# Altium project Schema_MaletteDevasion.PrjPcb
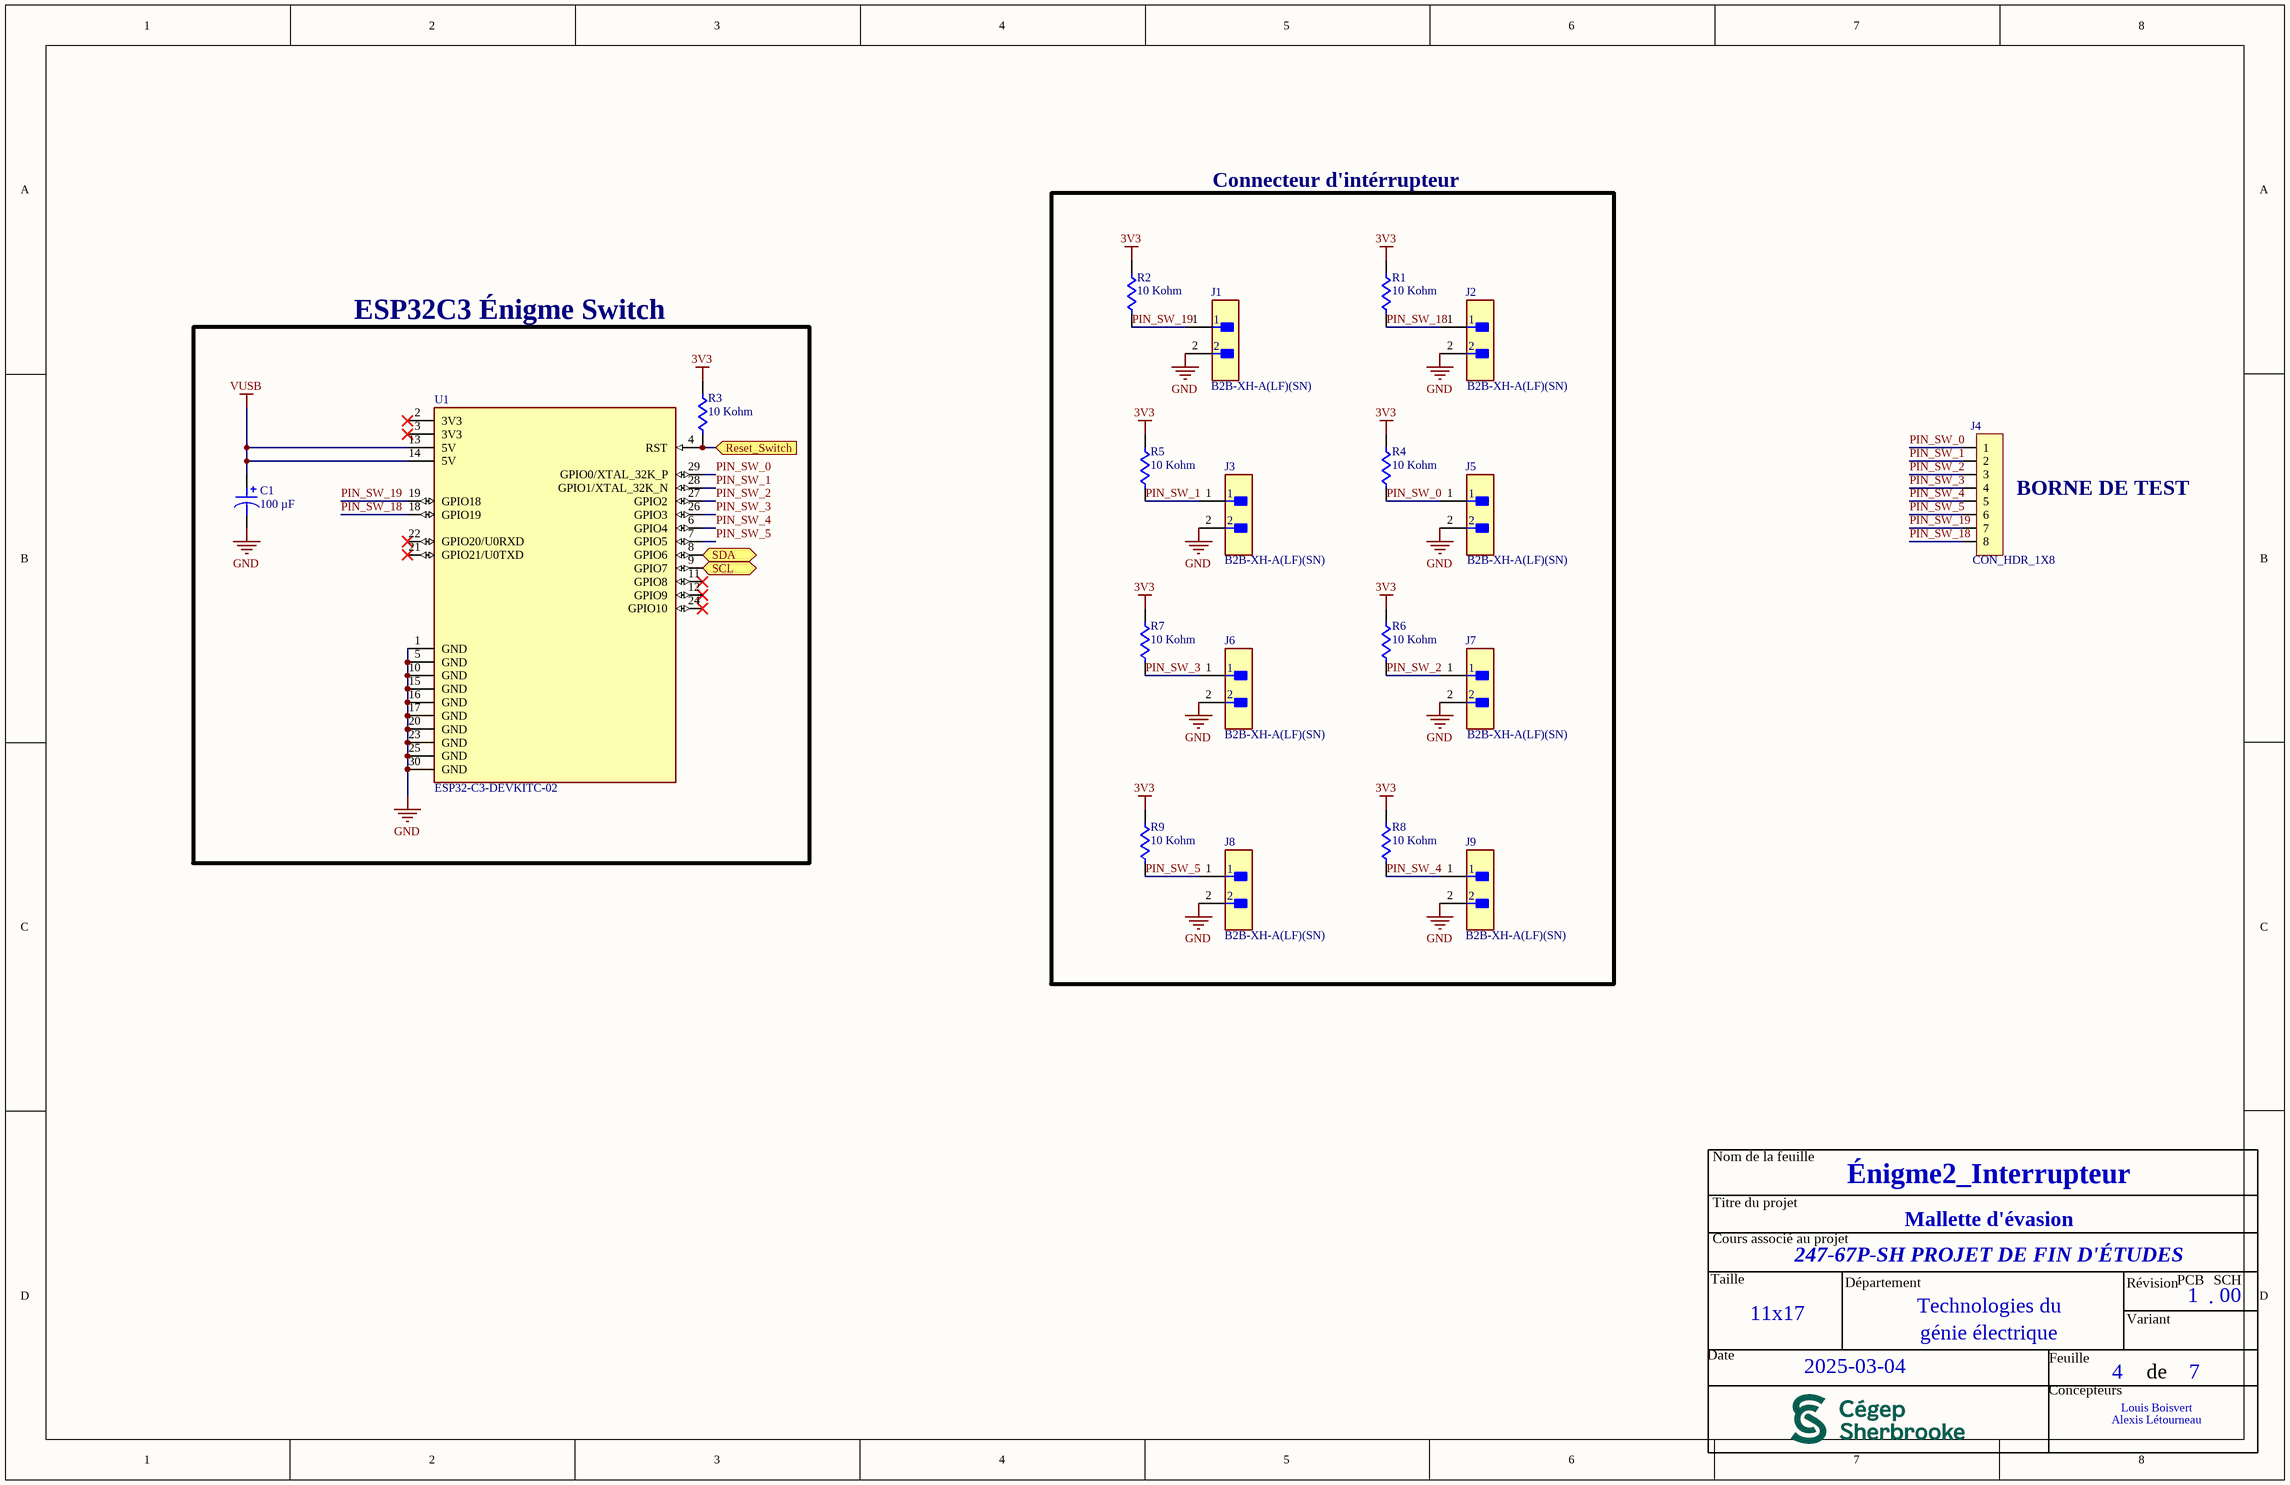
[diagram p0: Énigme1_Switch.SchDoc]
Projet_Concepteur1: Louis Boisvert; Projet_Concepteur2: Alexis Létourneau; Projet_Date: 2025-03-04; Projet_nom_du_cours: 247-67P-SH PROJET DE FIN D'ÉTUDES; Projet_PCB_Rev: 1; Projet_SCH_Rev: 00; Projet_stencil_Bot_epaisseur: 0.1 MM; Projet_stencil_Top_epaisseur: 0.1 MM; Projet_Titre: Mallette d'évasion
4 sheets, 82 parts. Net scope: flat (ports and power ports of the same name join across sheets).
Board files: TEMPLATE_PCB_2L.PcbDoc, MalletteV2_PCB_2L.PcbDoc
Sheets:
  Énigme1_Switch.SchDoc
  Énigme2_Crocodile.SchDoc
  Énigme3_Potentiomètres.SchDoc
  Raspberry_Pi_4_ModelB.SchDoc

## Sheet Énigme1_Switch.SchDoc
size Tabloid; DocumentNumber: 4; SheetNumber: 4; SheetTotal: 7; Sheet_Name: Énigme2_Interrupteur; Size: 11x17; SPICEModelCache: <root> / <DocumentId>IJWHLXDW</DocumentId> / </root>

### Parts
C1  100 µF  [CAP AL TH D8 L3.5 H12.5]
J1  B2B-XH-A(LF)(SN)  [FP-B2B-XH-A_LF_SN-MFG]
J2  B2B-XH-A(LF)(SN)  [FP-B2B-XH-A_LF_SN-MFG]
J3  B2B-XH-A(LF)(SN)  [FP-B2B-XH-A_LF_SN-MFG]
J4  CON_HDR_1X8  [CON_HDR_1x8]
J5  B2B-XH-A(LF)(SN)  [FP-B2B-XH-A_LF_SN-MFG]
J6  B2B-XH-A(LF)(SN)  [FP-B2B-XH-A_LF_SN-MFG]
J7  B2B-XH-A(LF)(SN)  [FP-B2B-XH-A_LF_SN-MFG]
J8  B2B-XH-A(LF)(SN)  [FP-B2B-XH-A_LF_SN-MFG]
J9  B2B-XH-A(LF)(SN)  [FP-B2B-XH-A_LF_SN-MFG]
R1  10 Kohm  [Res_Template]
R2  10 Kohm  [Res_Template]
R3  10 Kohm  [Res_Template]
R4  10 Kohm  [Res_Template]
R5  10 Kohm  [Res_Template]
R6  10 Kohm  [Res_Template]
R7  10 Kohm  [Res_Template]
R8  10 Kohm  [Res_Template]
R9  10 Kohm  [Res_Template]
U1  ESP32-C3-DEVKITC-02  [XCVR_ESP32-C3-DEVKITC-02]

### Blocks framed on the sheet
Connecteur d'intérrupteur: J1-J3 J5-J9 R1 R2 R4-R9
ESP32C3 Énigme Switch: C1 R3 U1

### Ports
Reset_Switch (in), SCL (bidir), SDA (bidir)

### Nets
3V3: R1.2 R2.2 R3.2 R4.2 R5.2 R6.2 R7.2 R8.2 R9.2
GND: C1.2 J1.2 J2.2 J3.2 J5.2 J6.2 J7.2 J8.2 J9.2 U1.1(GND) U1.5(GND) U1.10(GND) U1.15(GND) U1.16(GND) U1.17(GND) U1.20(GND) U1.23(GND) U1.25(GND) U1.30(GND)
VUSB: C1.1 U1.13(5V) U1.14(5V)
PIN_SW_0: J4.1 J5.1 R4.1 U1.29(GPIO0/XTAL_32K_P)
PIN_SW_1: J3.1 J4.2 R5.1 U1.28(GPIO1/XTAL_32K_N)
PIN_SW_2: J4.3 J7.1 R6.1 U1.27(GPIO2)
PIN_SW_3: J4.4 J6.1 R7.1 U1.26(GPIO3)
PIN_SW_4: J4.5 J9.1 R8.1 U1.6(GPIO4)
PIN_SW_5: J4.6 J8.1 R9.1 U1.7(GPIO5)
PIN_SW_18: J2.1 J4.8 R1.1 U1.18(GPIO19)
PIN_SW_19: J1.1 J4.7 R2.1 U1.19(GPIO18)
Reset_Switch: R3.1 U1.4(RST) ; port Reset_Switch
SCL: U1.9(GPIO7) ; port SCL
SDA: U1.8(GPIO6) ; port SDA

Not connected (* = marked no-connect by the designer): U1 2(3V3)* 3(3V3)* 11(GPIO8)* 12(GPIO9)* 21(GPIO21/U0TXD)* 22(GPIO20/U0RXD)* 24(GPIO10)*

### Notes on the sheet
- (near J4) BORNE DE TEST
- Nom de la feuille
- Titre du projet
- Cours associé au projet
- Taille
- Département
- Technologies du
- Révision
- PCB
- .
- SCH
- Date
- génie électrique
- Feuille
- Variant
- de
- Concepteurs

### Library data of the parts
C1 = 860020674015: CAP ALUM 100UF 20% 50V RADIAL; manufacturer: Würth Elektronik; Lifetime @ Temp.: 2000 Hrs @ 105°C; Polarization: Polar; Ripple Current @ High Frequency: 306 mA @ 100 kHz; Ripple Current @ Low Frequency: 200 mA @ 120 Hz; Part Number: 860020674015; Applications: General Purpose; Capacitance: 100 µF; componentlink1description: Datasheet; componentlink1url: https://katalog.we-online.de/pbs/datasheet/860020674015.pdf; componentlink2description: DigiKey Link; componentlink2url: https://www.digikey.com/en/products/detail/würth-elektronik/860020674015/5727098; Device Package: Radial, Can; Height - Seated (Max): 0.492" (12.50mm); lastupdated: 2024-06-03 20:06:11; Lead Spacing: 0.138" (3.50mm); Lifecycle Status: Active; Minimum Order: 1; Mounting Type: Through Hole; Operating Temperature: -40°C ~ 105°C; Package / Case: Radial, Can; packaging: TapeAndBox; partid: 7238; Part Status: Active; price: 0.16; series: WCAP-ATG5; Size / Dimension: 0.315" Dia (8.00mm); Supplier 1: DigiKey; Supplier Part Number 1: 732-8861-1-ND; Tolerance: ±20%; value: 100 µF; Voltage - Rated: 50 V
J1-J3 J5-J9 = CMP-2000-05888-3: CONN HEADER VERT 2POS 2.5MM; Current Rating: 3A; Voltage Rating: 250V; Number of Contacts: 2; Contact Resistance: 20mR; Wire/Cable Gauge: 22AWG; Insulation Resistance: 1GR; Connector Type: Male Pin; Packaging: Bulk; Contact Material: Brass; Lead Free: Lead Free; Orientation: Straight; Contact Plating: Tin; Max Current Rating: 3A; Termination: Solder; Fastening Type: Detent; Depth: 5.75mm; Housing Material: Polyamide; REACH SVHC: No SVHC; Series: XH; Voltage Rating (AC): 250V; Number of Positions: 2; Color: Natural; Contact Type: Male Pin; Max Voltage Rating (DC): 250V; Pitch: 2.5mm; Lead Pitch: 2.5mm; Mount: Through Hole; Max Operating Temperature: 85°C; Length: 7.4mm; Max Voltage Rating (AC): 250V; Min Operating Temperature: -25°C; Number of Rows: 1; Housing Color: White
J4 = CMP-005-000004-1: CON - Header 1X8 pins, 100Mils - TH-8; Polarized: No; Note: *; Power Max: *; Component Type: Standard; Manufacturer #1: *; Design Item ID: CON_HDR_1X8; Assembly Type: TH; HelpURL: *; Pin Count: 8; Package: TH-8; Source: CEGEP_SHERBROOKE_TGE_LIBRARY.SchLib
R1-R9 = 470 ohm: Custom Semiconductor Resistor
U1 = ESP32-C3-DEVKITC-02: Development Boards & Kits - Wireless (Engineering Samples) ESP32-C3 General-Purpose Development Board, embeds ESP32-C3-WROOM-02, 4 MB Flash, with Pin Header; MF: Espressif Systems; Purchase-URL: https://www.digikey.ca/en/products/detail/espressif-systems/ESP32-C3-DEVKITC-02/14553009?gclsrc=aw.ds&&utm_adgroup=&utm_source=google&utm_medium=cpc&utm_campaign=PMax%20Product_Low%20ROAS%20Categories&utm_term=&productid=14553009&utm_content=&utm_id=go_cmp-20291741422_adg-_ad-__dev-c_ext-_prd-14553009_sig-CjwKCAiAh6y9BhBREiwApBLHC_cF2gDRygapSaJLXU2Wdnx3_ghIaBBBCKe6dQeqHq45MeITmry7OBoCG4EQAvD_BwE&gad_source=1&gclid=CjwKCAiAh6y9BhBREiwApBLHC_cF2gDRygapSaJLXU2Wdnx3_ghIaBBBCKe6dQeqHq45MeITmry7OBoCG4EQAvD_BwE; Package: None; MP: ESP32-C3-DevKitC-02; Price: 12.94$; Availability: In Stock; SnapEDA_Link: https://www.snapeda.com/parts/ESP32-C3-DevKitC-02/Espressif+Systems/view-part/?ref=snap; Check_prices: https://www.snapeda.com/parts/ESP32-C3-DevKitC-02/Espressif+Systems/view-part/?ref=eda; ComponentLink1Description: New link; ComponentLink1URL: https://docs.espressif.com/projects/esp-idf/en/v5.2/esp32c3/hw-reference/esp32c3/user-guide-devkitc-02.html

## Sheet Énigme2_Crocodile.SchDoc
size Tabloid; Date: Date; Author: Author 1; DocumentNumber: 5; Revision: 1; SheetNumber: 5; SheetTotal: 7; Size: 11x17; Sheet_Name: Énigme2_Pince_Banane; SPICEModelCacheRTYEHROU: <root> / <DocumentId>RTYEHROU</DocumentId> / </root>
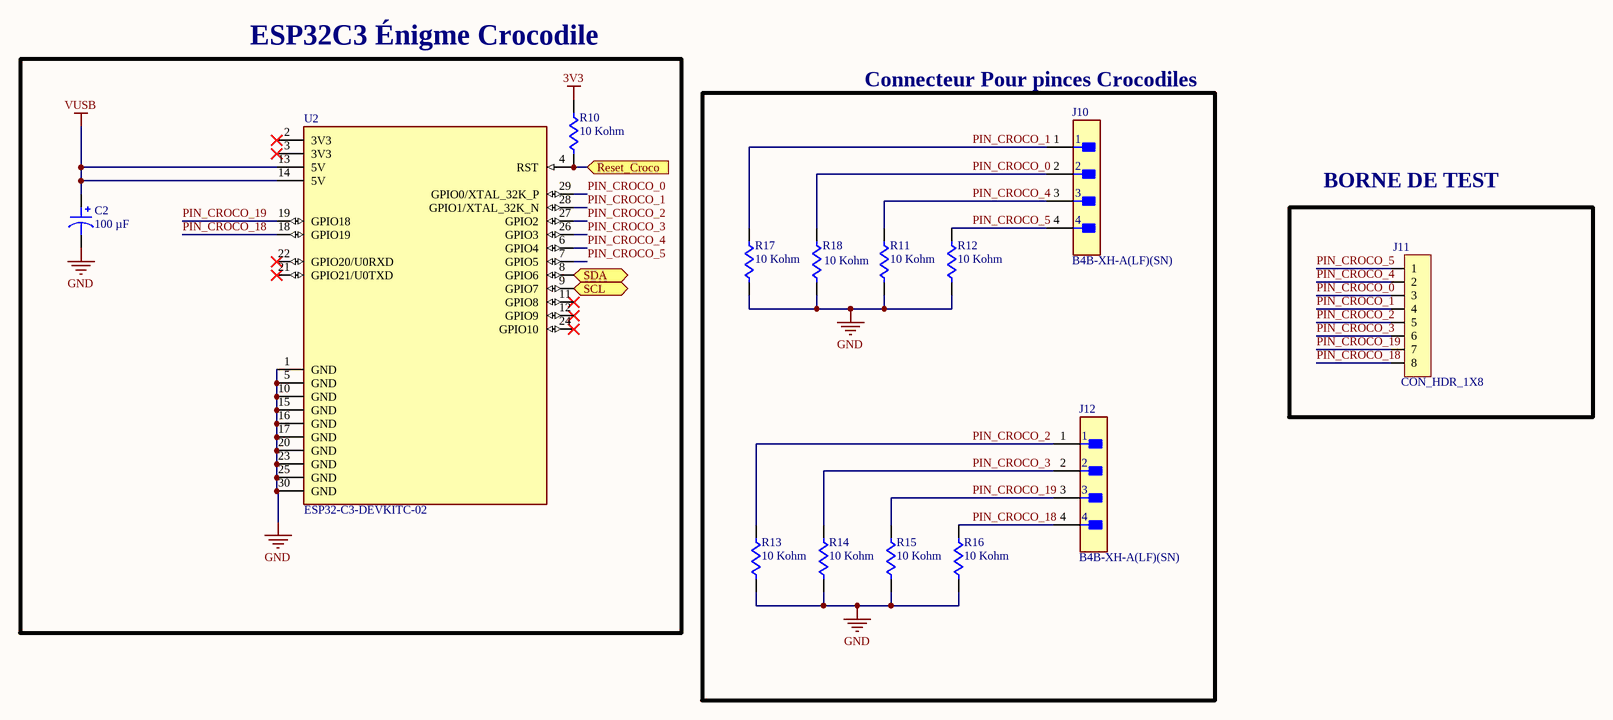
[diagram p1: Énigme2_Crocodile.SchDoc]

### Parts
C2  100 µF  [CAP AL TH D8 L3.5 H12.5]
J10  B4B-XH-A(LF)(SN)  [FP-B4B-XH-A_LF_SN-MFG]
J11  CON_HDR_1X8  [CON_HDR_1x8]
J12  B4B-XH-A(LF)(SN)  [FP-B4B-XH-A_LF_SN-MFG]
R10  10 Kohm  [Res_Template]
R11  10 Kohm  [Res_Template]
R12  10 Kohm  [Res_Template]
R13  10 Kohm  [Res_Template]
R14  10 Kohm  [Res_Template]
R15  10 Kohm  [Res_Template]
R16  10 Kohm  [Res_Template]
R17  10 Kohm  [Res_Template]
R18  10 Kohm  [Res_Template]
U2  ESP32-C3-DEVKITC-02  [XCVR_ESP32-C3-DEVKITC-02]

### Blocks framed on the sheet
ESP32C3 Énigme Crocodile: C2 R10 U2
Connecteur Pour pinces Crocodiles: J10 J12 R11-R18
BORNE DE TEST: J11

### Ports
Reset_Croco (in), SCL (bidir), SDA (bidir)

### Nets
3V3: R10.2
GND: C2.2 R11.1 R12.1 R13.1 R14.1 R15.1 R16.1 R17.1 R18.1 U2.1(GND) U2.5(GND) U2.10(GND) U2.15(GND) U2.16(GND) U2.17(GND) U2.20(GND) U2.23(GND) U2.25(GND) U2.30(GND)
VUSB: C2.1 U2.13(5V) U2.14(5V)
PIN_CROCO_0: J10.2 J11.3 R18.2 U2.29(GPIO0/XTAL_32K_P)
PIN_CROCO_1: J10.1 J11.4 R17.2 U2.28(GPIO1/XTAL_32K_N)
PIN_CROCO_2: J11.5 J12.1 R13.2 U2.27(GPIO2)
PIN_CROCO_3: J11.6 J12.2 R14.2 U2.26(GPIO3)
PIN_CROCO_4: J10.3 J11.2 R11.2 U2.6(GPIO4)
PIN_CROCO_5: J10.4 J11.1 R12.2 U2.7(GPIO5)
PIN_CROCO_18: J11.8 J12.4 R16.2 U2.18(GPIO19)
PIN_CROCO_19: J11.7 J12.3 R15.2 U2.19(GPIO18)
Reset_Croco: R10.1 U2.4(RST) ; port Reset_Croco
SCL: U2.9(GPIO7) ; port SCL
SDA: U2.8(GPIO6) ; port SDA

Not connected (* = marked no-connect by the designer): U2 2(3V3)* 3(3V3)* 11(GPIO8)* 12(GPIO9)* 21(GPIO21/U0TXD)* 22(GPIO20/U0RXD)* 24(GPIO10)*

### Notes on the sheet
- Nom de la feuille
- Titre du projet
- Cours associé au projet
- Taille
- Département
- Technologies du
- Révision
- PCB
- .
- SCH
- Date
- génie électrique
- Feuille
- Variant
- de
- Concepteurs

### Library data of the parts
C2 = 860020674015: as C1 on sheet Énigme1_Switch; Part Number: 860020674015; Applications: General Purpose; Capacitance: 100 µF; componentlink1description: Datasheet; componentlink1url: https://katalog.we-online.de/pbs/datasheet/860020674015.pdf; componentlink2description: DigiKey Link; componentlink2url: https://www.digikey.com/en/products/detail/würth-elektronik/860020674015/5727098; Device Package: Radial, Can; Height - Seated (Max): 0.492" (12.50mm); lastupdated: 2024-06-03 20:06:11; Lead Spacing: 0.138" (3.50mm); Lifecycle Status: Active; Minimum Order: 1; Mounting Type: Through Hole; Operating Temperature: -40°C ~ 105°C; Package / Case: Radial, Can; packaging: TapeAndBox; partid: 7238; Part Status: Active; price: 0.16; series: WCAP-ATG5; Size / Dimension: 0.315" Dia (8.00mm); Supplier 1: DigiKey; Supplier Part Number 1: 732-8861-1-ND; Tolerance: ±20%; value: 100 µF; Voltage - Rated: 50 V
J10 J12 = CMP-17439-000250-1: CONN HEADER VERT 4POS 2.5MM; Number of Contacts: 4; Contact Resistance: 20mR; Voltage Rating: 250V; Max Current Rating: 3A; Gender: Male; Wire/Cable Gauge: 22AWG; Mated Stacking Heights: 9.8mm; Insulation Resistance: 1GR; Orientation: Straight; Contact Type: Male Pin; Contact Finish - Mating: TIN; Series: XH; Max Voltage Rating (AC): 250V; Lead Pitch: 2.5mm; Contact Shape: Square; Insulation Color: Natural; Termination: Solder; Lead Free: Lead Free; Voltage Rating (AC): 250V; Number of Rows: 1; Flammability Rating: UL94 V-0; Number of Positions: 4; Max Operating Temperature: 85°C; Package Quantity: 500; Mount: Through Hole; REACH SVHC: No SVHC; Connector Type: Header; Insulation Material: Nylon; Fastening Type: Detent; Min Operating Temperature: -25°C; Housing Color: White; Packaging: Bulk; Contact Plating: Tin; Contact Material: Brass; Max Voltage Rating (DC): 250V; Housing Material: Polyamide; Color: Natural; Material: Polyamide; Pitch: 2.5mm; Depth: 5.75mm; Current Rating: 3A; Length: 12.4mm
J11 = CMP-005-000004-1: as J4 on sheet Énigme1_Switch; Note: *; Power Max: *; Component Type: Standard; Manufacturer #1: *; Design Item ID: CON_HDR_1X8; Assembly Type: TH; HelpURL: *; Pin Count: 8; Package: TH-8; Source: CEGEP_SHERBROOKE_TGE_LIBRARY.SchLib
R10-R18 = 470 ohm: Custom Semiconductor Resistor
U2 = ESP32-C3-DEVKITC-02: as U1 on sheet Énigme1_Switch; Purchase-URL: https://www.digikey.ca/en/products/detail/espressif-systems/ESP32-C3-DEVKITC-02/14553009?gclsrc=aw.ds&&utm_adgroup=&utm_source=google&utm_medium=cpc&utm_campaign=PMax%20Product_Low%20ROAS%20Categories&utm_term=&productid=14553009&utm_content=&utm_id=go_cmp-20291741422_adg-_ad-__dev-c_ext-_prd-14553009_sig-CjwKCAiAh6y9BhBREiwApBLHC_cF2gDRygapSaJLXU2Wdnx3_ghIaBBBCKe6dQeqHq45MeITmry7OBoCG4EQAvD_BwE&gad_source=1&gclid=CjwKCAiAh6y9BhBREiwApBLHC_cF2gDRygapSaJLXU2Wdnx3_ghIaBBBCKe6dQeqHq45MeITmry7OBoCG4EQAvD_BwE; Package: None; MP: ESP32-C3-DevKitC-02; Price: 12.94$; Availability: In Stock; SnapEDA_Link: https://www.snapeda.com/parts/ESP32-C3-DevKitC-02/Espressif+Systems/view-part/?ref=snap; Check_prices: https://www.snapeda.com/parts/ESP32-C3-DevKitC-02/Espressif+Systems/view-part/?ref=eda; ComponentLink1Description: New link; ComponentLink1URL: https://docs.espressif.com/projects/esp-idf/en/v5.2/esp32c3/hw-reference/esp32c3/user-guide-devkitc-02.html

## Sheet Énigme3_Potentiomètres.SchDoc
size Tabloid; Date: Date; Author: Author 1; DocumentNumber: 6; Revision: 1; SheetNumber: 6; SheetTotal: 7; Size: 11x17; Sheet_Name: Énigme3_Potentiomètre; SPICEModelCacheRTYEHROU: <root> / <DocumentId>RTYEHROU</DocumentId> / </root>
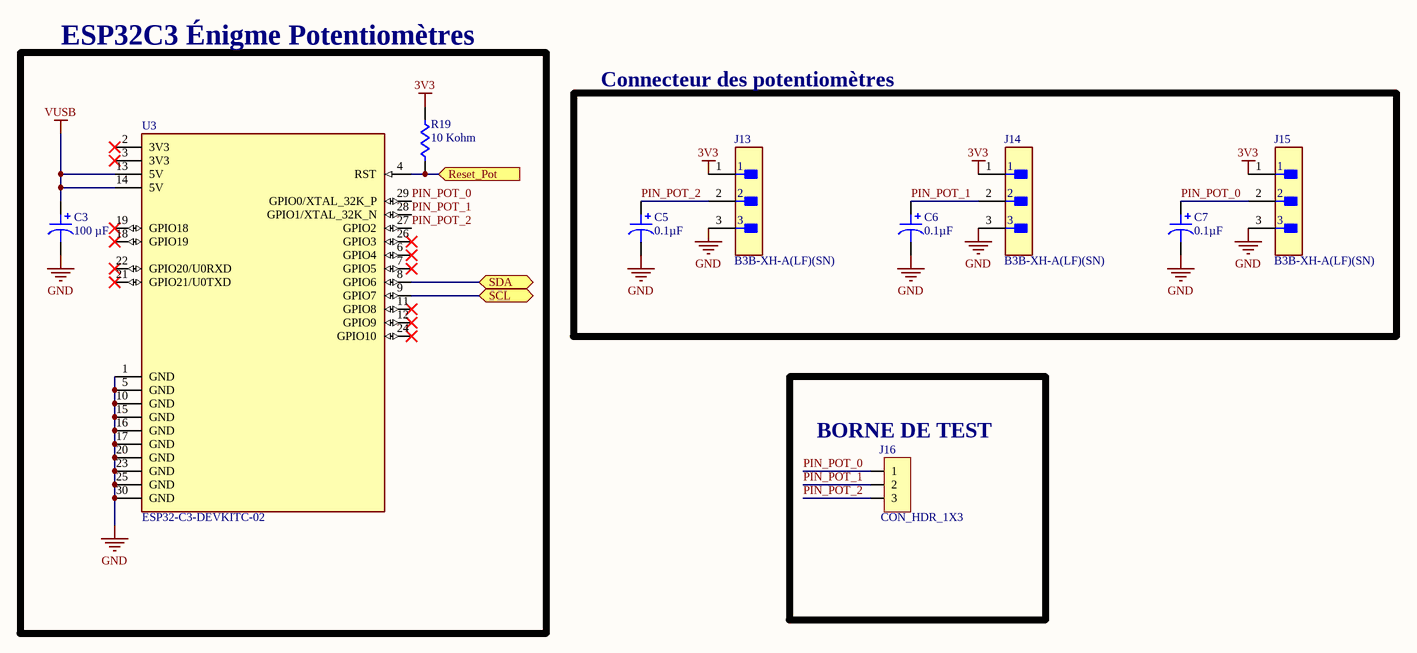
[diagram p2: Énigme3_Potentiomètres.SchDoc]

### Parts
C3  100 µF  [CAP AL TH D8 L3.5 H12.5]
C5  0.1µF  [CAP TH ALUM ELEC D5.00mm S2.00mm H12.00mm]
C6  0.1µF  [CAP TH ALUM ELEC D5.00mm S2.00mm H12.00mm]
C7  0.1µF  [CAP TH ALUM ELEC D5.00mm S2.00mm H12.00mm]
J13  B3B-XH-A(LF)(SN)  [FP-B3B-XH-A_LF_SN-MFG]
J14  B3B-XH-A(LF)(SN)  [FP-B3B-XH-A_LF_SN-MFG]
J15  B3B-XH-A(LF)(SN)  [FP-B3B-XH-A_LF_SN-MFG]
J16  CON_HDR_1X3  [CON_HDR_1x3]
R19  10 Kohm  [Res_Template]
U3  ESP32-C3-DEVKITC-02  [XCVR_ESP32-C3-DEVKITC-02]

### Blocks framed on the sheet
ESP32C3 Énigme Potentiomètres: C3 R19 U3
Connecteur des potentiomètres: C5-C7 J13-J15
BORNE DE TEST: J16

### Ports
Reset_Pot (in), SCL (bidir), SDA (bidir)

### Nets
3V3: J13.1 J14.1 J15.1 R19.2
GND: C3.2 C5.2 C6.2 C7.2 J13.3 J14.3 J15.3 U3.1(GND) U3.5(GND) U3.10(GND) U3.15(GND) U3.16(GND) U3.17(GND) U3.20(GND) U3.23(GND) U3.25(GND) U3.30(GND)
VUSB: C3.1 U3.13(5V) U3.14(5V)
PIN_POT_0: C7.1 J15.2 J16.1 U3.29(GPIO0/XTAL_32K_P)
PIN_POT_1: C6.1 J14.2 J16.2 U3.28(GPIO1/XTAL_32K_N)
PIN_POT_2: C5.1 J13.2 J16.3 U3.27(GPIO2)
Reset_Pot: R19.1 U3.4(RST) ; port Reset_Pot
SCL: U3.9(GPIO7) ; port SCL
SDA: U3.8(GPIO6) ; port SDA

Not connected (* = marked no-connect by the designer): U3 2(3V3)* 3(3V3)* 6(GPIO4)* 7(GPIO5)* 11(GPIO8)* 12(GPIO9)* 18(GPIO19)* 19(GPIO18)* 21(GPIO21/U0TXD)* 22(GPIO20/U0RXD)* 24(GPIO10)* 26(GPIO3)*

### Notes on the sheet
- Nom de la feuille
- Titre du projet
- Cours associé au projet
- Taille
- Département
- Technologies du
- Révision
- PCB
- .
- SCH
- Date
- génie électrique
- Feuille
- Variant
- de
- Concepteurs

### Library data of the parts
C3 = 860020674015: as C1 on sheet Énigme1_Switch; Part Number: 860020674015; Applications: General Purpose; Capacitance: 100 µF; componentlink1description: Datasheet; componentlink1url: https://katalog.we-online.de/pbs/datasheet/860020674015.pdf; componentlink2description: DigiKey Link; componentlink2url: https://www.digikey.com/en/products/detail/würth-elektronik/860020674015/5727098; Device Package: Radial, Can; Height - Seated (Max): 0.492" (12.50mm); lastupdated: 2024-06-03 20:06:11; Lead Spacing: 0.138" (3.50mm); Lifecycle Status: Active; Minimum Order: 1; Mounting Type: Through Hole; Operating Temperature: -40°C ~ 105°C; Package / Case: Radial, Can; packaging: TapeAndBox; partid: 7238; Part Status: Active; price: 0.16; series: WCAP-ATG5; Size / Dimension: 0.315" Dia (8.00mm); Supplier 1: DigiKey; Supplier Part Number 1: 732-8861-1-ND; Tolerance: ±20%; value: 100 µF; Voltage - Rated: 50 V
C5-C7 = UKL2A0R1KDD: CAP ALUM 0.1UF 10% 100V RADIAL; manufacturer: Nichicon; Lifetime @ Temp.: 2000 Hrs @ 85°C; Polarization: Polar; Ripple Current @ High Frequency: 4.2mA @ 10kHz; Ripple Current @ Low Frequency: 2.1mA @ 120Hz; Part Number: UKL2A0R1KDD; Applications: General Purpose; Capacitance: 0.1µF; componentlink1description: Datasheet; componentlink1url: http://nichicon-us.com/english/products/pdfs/e-ukl.pdf; componentlink2description: DigiKey Link; componentlink2url: http://digikey.com/product-detail/en/nichicon/UKL2A0R1KDD/493-16876-ND/2598554; Device Package: Radial, Can; Height - Seated (Max): 0.472" (12.00mm); lastupdated: 2020-09-04 23:28:57; Lead Spacing: 0.079" (2.00mm); Lifecycle Status: Active; Minimum Order: 1; Mounting Type: Through Hole; Operating Temperature: -40°C ~ 85°C; Package / Case: Radial, Can; packaging: Bulk; partid: 21583; Part Status: Active; price: 0.39; series: UKL; Size / Dimension: 0.197" Dia (5.00mm); Supplier 1: DigiKey; Supplier Part Number 1: 493-16876-ND; Tolerance: ±10%; value: 0.1µF; Voltage - Rated: 100V
J13-J15 = CMP-17439-000014-3: CONN HEADER VERT 3POS 2.5MM; Max Voltage Rating (DC): 250V; Number of Positions: 3; Current Rating: 3A; Gender: Male; Wire/Cable Gauge: 22AWG; Contact Resistance: 20mR; Insulation Resistance: 1GR; Insulation Material: Nylon; Contact Plating: Tin; Depth: 5.75mm; Contact Type: Male Pin; Max Operating Temperature: 85°C; Insulation Color: Natural; Voltage Rating (AC): 250V; Color: Natural; Connector Type: Header; Orientation: Straight; Fastening Type: Detent; Housing Color: White; Min Operating Temperature: -25°C; Termination: Solder; Voltage Rating: 250V; Series: XH; Pitch: 2.5mm; Contact Shape: Square; Number of Rows: 1; Lead Free: Lead Free; Packaging: Bulk; Mount: Through Hole; Flammability Rating: UL94 V-0; Max Voltage Rating (AC): 250V; REACH SVHC: No SVHC; Housing Material: Polyamide; Contact Material: Brass; Lead Pitch: 2.5mm; Contact Finish - Mating: TIN; Length: 9.9mm; Max Current Rating: 3A; Number of Contacts: 3
J16 = CMP-005-000001-1: CON - Header 1x3 pins-100Mils - TH; Polarized: No; Source: CEGEP_SHERBROOKE_TGE_LIBRARY.SchLib; Component Type: Standard; Package: TH; Power Max: *; Pin Count: 3; Design Item ID: CON_HDR_1X3; Note: *; Manufacturer #1: *; HelpURL: *; Assembly Type: TH
R19 = 470 ohm: Custom Semiconductor Resistor
U3 = ESP32-C3-DEVKITC-02: as U1 on sheet Énigme1_Switch; Purchase-URL: https://www.digikey.ca/en/products/detail/espressif-systems/ESP32-C3-DEVKITC-02/14553009?gclsrc=aw.ds&&utm_adgroup=&utm_source=google&utm_medium=cpc&utm_campaign=PMax%20Product_Low%20ROAS%20Categories&utm_term=&productid=14553009&utm_content=&utm_id=go_cmp-20291741422_adg-_ad-__dev-c_ext-_prd-14553009_sig-CjwKCAiAh6y9BhBREiwApBLHC_cF2gDRygapSaJLXU2Wdnx3_ghIaBBBCKe6dQeqHq45MeITmry7OBoCG4EQAvD_BwE&gad_source=1&gclid=CjwKCAiAh6y9BhBREiwApBLHC_cF2gDRygapSaJLXU2Wdnx3_ghIaBBBCKe6dQeqHq45MeITmry7OBoCG4EQAvD_BwE; Package: None; MP: ESP32-C3-DevKitC-02; Price: 12.94$; Availability: In Stock; SnapEDA_Link: https://www.snapeda.com/parts/ESP32-C3-DevKitC-02/Espressif+Systems/view-part/?ref=snap; Check_prices: https://www.snapeda.com/parts/ESP32-C3-DevKitC-02/Espressif+Systems/view-part/?ref=eda; ComponentLink1Description: New link; ComponentLink1URL: https://docs.espressif.com/projects/esp-idf/en/v5.2/esp32c3/hw-reference/esp32c3/user-guide-devkitc-02.html

## Sheet Raspberry_Pi_4_ModelB.SchDoc
size Tabloid; Date: Date; Author: Author 1; DocumentNumber: 7; Revision: 1; SheetNumber: 7; SheetTotal: 7; Size: 11x17; Sheet_Name: Raspberry_Pi; SPICEModelCacheRTYEHROU: <root> / <DocumentId>RTYEHROU</DocumentId> / </root>
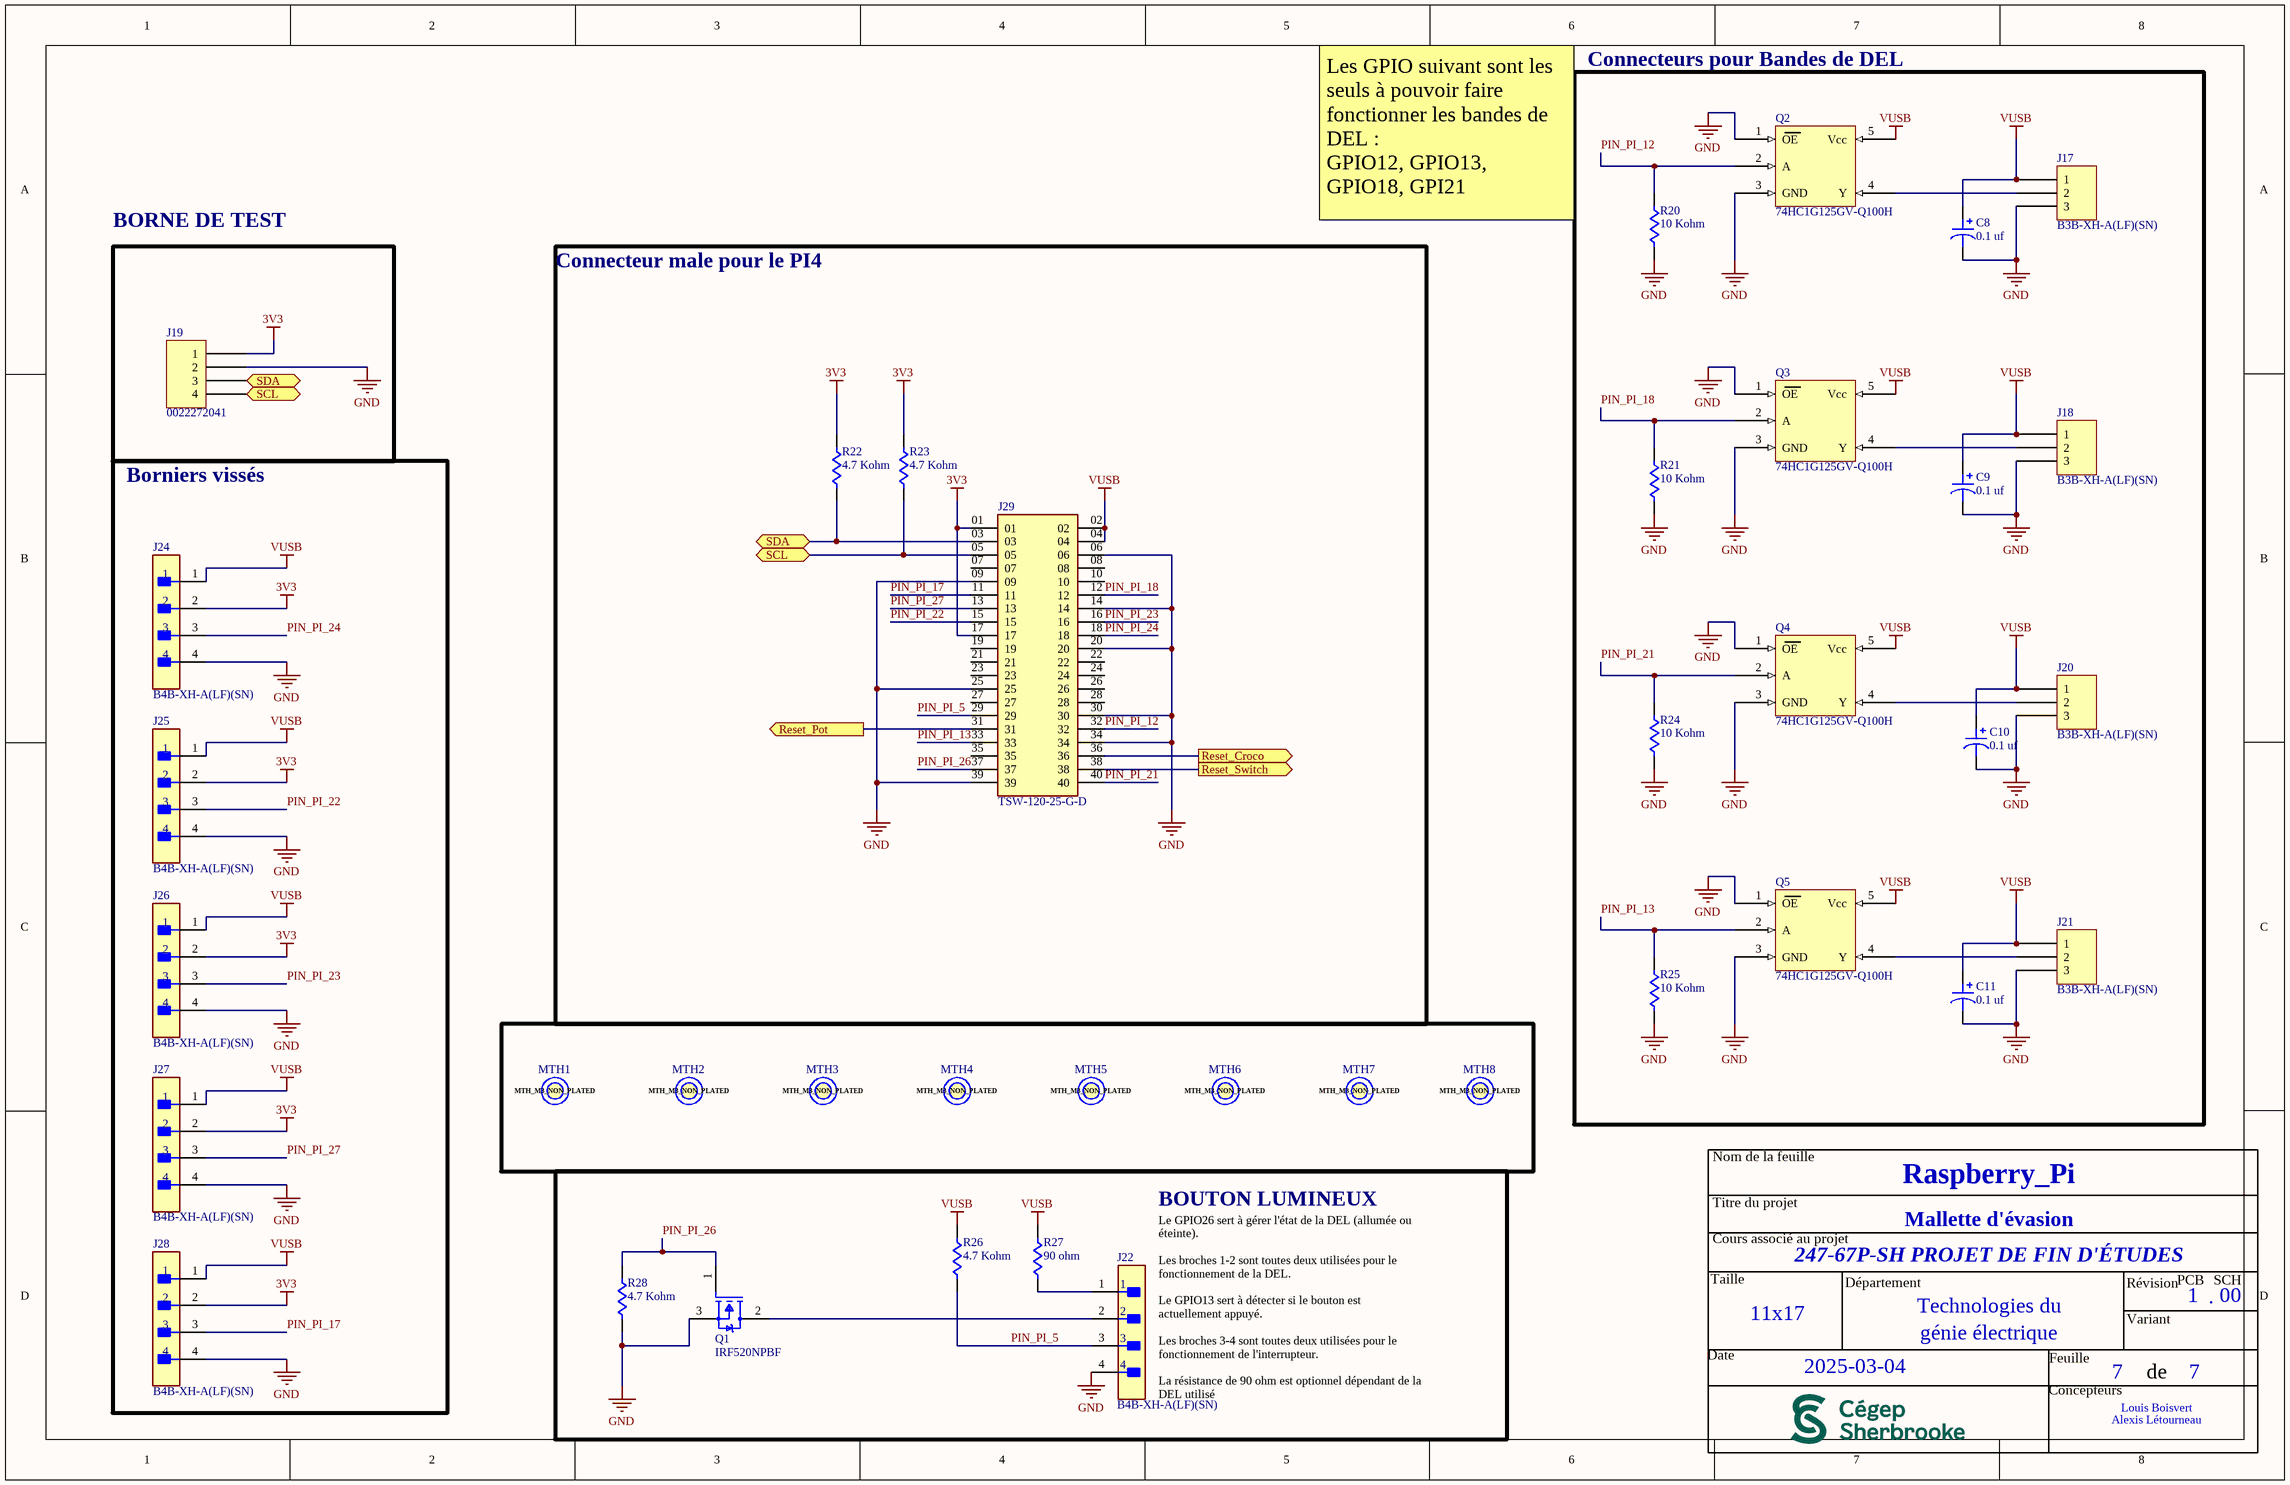
[diagram p3: Raspberry_Pi_4_ModelB.SchDoc]

### Parts
C8  0.1 uf  [CAP TH ALPOLY D8.00mm S3.50mm H21.50mm]
C9  0.1 uf  [CAP TH ALPOLY D8.00mm S3.50mm H21.50mm]
C10  0.1 uf  [CAP TH ALPOLY D8.00mm S3.50mm H21.50mm]
C11  0.1 uf  [CAP TH ALPOLY D8.00mm S3.50mm H21.50mm]
J17  B3B-XH-A(LF)(SN)  [JST XH B3B-XH-A]
J18  B3B-XH-A(LF)(SN)  [JST XH B3B-XH-A]
J19  0022272041  [MOLEX KK 0022272041]
J20  B3B-XH-A(LF)(SN)  [JST XH B3B-XH-A]
J21  B3B-XH-A(LF)(SN)  [JST XH B3B-XH-A]
J22  B4B-XH-A(LF)(SN)  [FP-B4B-XH-A_LF_SN-MFG]
J24  B4B-XH-A(LF)(SN)  [FP-B4B-XH-A_LF_SN-MFG]
J25  B4B-XH-A(LF)(SN)  [FP-B4B-XH-A_LF_SN-MFG]
J26  B4B-XH-A(LF)(SN)  [FP-B4B-XH-A_LF_SN-MFG]
J27  B4B-XH-A(LF)(SN)  [FP-B4B-XH-A_LF_SN-MFG]
J28  B4B-XH-A(LF)(SN)  [FP-B4B-XH-A_LF_SN-MFG]
J29  TSW-120-25-G-D  [SAMTEC_TSW-120-25-G-D]
MTH1  MTH_M3_NON_PLATED  [MTH_M3_NON_PLATED]  (no BOM)
MTH2  MTH_M3_NON_PLATED  [MTH_M3_NON_PLATED]  (no BOM)
MTH3  MTH_M3_NON_PLATED  [MTH_M3_NON_PLATED]  (no BOM)
MTH4  MTH_M3_NON_PLATED  [MTH_M3_NON_PLATED]  (no BOM)
MTH5  MTH_M3_NON_PLATED  [MTH_M3_NON_PLATED]  (no BOM)
MTH6  MTH_M3_NON_PLATED  [MTH_M3_NON_PLATED]  (no BOM)
MTH7  MTH_M3_NON_PLATED  [MTH_M3_NON_PLATED]  (no BOM)
MTH8  MTH_M3_NON_PLATED  [MTH_M3_NON_PLATED]  (no BOM)
Q1  IRF520NPBF  [FP-PG-TO220-3-MFG]
Q2  74HC1G125GV-Q100H  [SOT95P275X110-5N]
Q3  74HC1G125GV-Q100H  [SOT95P275X110-5N]
Q4  74HC1G125GV-Q100H  [SOT95P275X110-5N]
Q5  74HC1G125GV-Q100H  [SOT95P275X110-5N]
R20  10 Kohm  [Res_Template]
R21  10 Kohm  [Res_Template]
R22  4.7 Kohm  [Res_Template]
R23  4.7 Kohm  [Res_Template]
R24  10 Kohm  [Res_Template]
R25  10 Kohm  [Res_Template]
R26  4.7 Kohm  [Res_Template]
R27  90 ohm  [Res_Template]
R28  4.7 Kohm  [Res_Template]

### Blocks framed on the sheet
Connecteurs pour Bandes de DEL: C8-C11 J17 J18 J20 J21 Q2-Q5 R20 R21 R24 R25
BORNE DE TEST: J19
Connecteur male pour le PI4: J29 R22 R23
Borniers vissés: J24-J28
BOUTON LUMINEUX: J22 Q1 R26-R28

### Ports
Reset_Croco (out), Reset_Pot (out), Reset_Switch (out), SCL (bidir), SDA (bidir)

### Nets
3V3: J19.1 J24.2 J25.2 J26.2 J27.2 J28.2 J29.01 J29.17 R22.2 R23.1
GND: C8.2 C9.2 C10.2 C11.2 J17.3 J18.3 J19.2 J20.3 J21.3 J22.4 J24.4 J25.4 J26.4 J27.4 J28.4 J29.06 J29.09 J29.14 J29.20 J29.25 J29.30 J29.34 J29.39 Q1.3(S) Q2.1(OE) Q2.3(GND) Q3.1(OE) Q3.3(GND) Q4.1(OE) Q4.3(GND) Q5.1(OE) Q5.3(GND) R20.1 R21.1 R24.1 R25.1 R28.1
VUSB: C8.1 C9.1 C10.1 C11.1 J17.1 J18.1 J20.1 J21.1 J24.1 J25.1 J26.1 J27.1 J28.1 J29.02 J29.04 Q2.5(Vcc) Q3.5(Vcc) Q4.5(Vcc) Q5.5(Vcc) R26.2 R27.2
PIN_PI_5: J22.3 J29.29 R26.1
PIN_PI_12: J29.32 Q2.2(A) R20.2
PIN_PI_13: J29.33 Q5.2(A) R25.2
PIN_PI_17: J28.3 J29.11
PIN_PI_18: J29.12 Q3.2(A) R21.2
PIN_PI_21: J29.40 Q4.2(A) R24.2
PIN_PI_22: J25.3 J29.15
PIN_PI_23: J26.3 J29.16
PIN_PI_24: J24.3 J29.18
PIN_PI_26: J29.37 Q1.1(G) R28.2
PIN_PI_27: J27.3 J29.13
Reset_Croco: J29.36 ; port Reset_Croco
Reset_Pot: J29.31 ; port Reset_Pot
Reset_Switch: J29.38 ; port Reset_Switch
SCL: J19.4 J29.05 R23.2 ; port SCL
SDA: J19.3 J29.03 R22.1 ; port SDA
NetJ17_2: J17.2 Q2.4(Y)
NetJ18_2: J18.2 Q3.4(Y)
NetJ20_2: J20.2 Q4.4(Y)
NetJ21_2: J21.2 Q5.4(Y)
NetJ22_1: J22.1 R27.1
NetJ22_2: J22.2 Q1.2(D)

Not connected (* = marked no-connect by the designer): J29 07 08 10 19 21 22 23 24 26 27 28 35

### Notes on the sheet
- Les GPIO suivant sont les seuls à pouvoir faire fonctionner les bandes de DEL :
  GPIO12, GPIO13, GPIO18, GPI21
- (near J22) Le GPIO26 sert à gérer l'état de la DEL (allumée ou éteinte).
  Les broches 1-2 sont toutes deux utilisées pour le fonctionnement de la DEL.
  Le GPIO13 sert à détecter si le bouton est actuellement appuyé.
  Les broches 3-4 sont toutes deux utilisées pour le fonctionnement de l'interrupteur.
  La résistance de 90 ohm est optionnel dépendant de la DEL utilisé
- Nom de la feuille
- Titre du projet
- Cours associé au projet
- Taille
- Département
- Technologies du
- Révision
- PCB
- .
- SCH
- Date
- génie électrique
- Feuille
- Variant
- de
- Concepteurs

### Library data of the parts
C8-C11 = APSG160ELL152MH20S: ALUMINUM CAPACITOR; manufacturer: Chemi-Con; Capacitance: 1.5 mF; ESR (Equivalent Series Resistance): 8mOhm; Lifetime @ Temp.: 20000 Hrs @ 105°C; Ripple Current @ High Frequency: 7.5 A @ 100 kHz; Ripple Current @ Low Frequency: 750 mA @ 120 Hz; Tolerance: ±20%; Type: Polymer; Voltage - Rated: 16 V; Part Number: APSG160ELL152MH20S; Value: 0.1 uf; Applications: General Purpose; componentlink1description: Datasheet; componentlink1url: https://www.chemi-con.co.jp/products/relatedfiles/capacitor/catalog/PSGLL-e.PDF; componentlink2description: DigiKey Link; componentlink2url: https://www.digikey.com/en/products/detail/chemi-con/APSG160ELL152MH20S/21805209; Height - Seated (Max): 0.846" (21.50mm); lastupdated: 2024-06-03 20:25:13; Lead Spacing: 0.138" (3.50mm); Lifecycle Status: Active; Minimum Order: 1; Mounting Type: Through Hole; Operating Temperature: -55°C ~ 105°C; packaging: Bulk; partid: 5888; price: 0.35; series: NPCAP™-PSG; Size / Dimension: 0.315" Dia (8.00mm); Supplier 1: DigiKey; Supplier Part Number 1: 565-APSG160ELL152MH20S-ND
J17 J18 J20 J21 = B3B-XH-A(LF)(SN): CONN HEADER VERT 3POS 2.5MM; Manufacturer: JST Sales America Inc.; Contact Length - Post: 0.134" (3.40mm); Current Rating (Amps): 3A; Material Flammability Rating: UL94 V-0; Number of Positions: 3; Number of Positions Loaded: All; Pitch - Mating: 0.098" (2.50mm); Shrouding: Shrouded - 4 Wall; Style: Board to Cable/Wire; Voltage Rating: 250V; Part Number: B3B-XH-A(LF)(SN); ComponentLink1Description: Datasheet; ComponentLink1URL: http://www.jst-mfg.com/product/pdf/eng/eXH.pdf; ComponentLink2Description: DigiKey Link; ComponentLink2URL: http://digikey.com/product-detail/en/jst-sales-america-inc/B3B-XH-A-LF-SN/455-2248-ND/1651046; Connector Type: Header; Contact Finish - Mating: Tin; Contact Finish - Post: Tin; Contact Material: Brass; Contact Shape: Square; Contact Type: Male Pin; Fastening Type: Detent Lock; Insulation Color: Natural; Insulation Height: 0.276" (7.00mm); Insulation Material: Polyamide (PA66), Nylon 6/6; LastUpdated: 2020-01-12 23:46:22; Lifecycle Status: Active; Minimum Order: 1; Mounting Type: Through Hole; Number of Rows: 1; Operating Temperature: -25°C ~ 85°C; Packaging: Bulk; PartId: 68; Part Status: Active; Price: 0.19; Series: XH; Supplier 1: DigiKey; Supplier Part Number 1: 455-2248-ND; Termination: Press-Fit, Solder
J19 = 0022272041: CONN HEADER VERT 4POS 2.54MM; Part Number: 0022272041
J22 J24-J28 = CMP-17439-000250-1: as J10 on sheet Énigme2_Crocodile; Orientation: Straight; Contact Type: Male Pin; Contact Finish - Mating: TIN; Series: XH; Max Voltage Rating (AC): 250V; Lead Pitch: 2.5mm; Contact Shape: Square; Insulation Color: Natural; Termination: Solder; Lead Free: Lead Free; Voltage Rating (AC): 250V; Number of Rows: 1; Flammability Rating: UL94 V-0; Number of Positions: 4; Max Operating Temperature: 85°C; Package Quantity: 500; Mount: Through Hole; REACH SVHC: No SVHC; Connector Type: Header; Insulation Material: Nylon; Fastening Type: Detent; Min Operating Temperature: -25°C; Housing Color: White; Packaging: Bulk; Contact Plating: Tin; Contact Material: Brass; Max Voltage Rating (DC): 250V; Housing Material: Polyamide; Color: Natural; Material: Polyamide; Pitch: 2.5mm; Depth: 5.75mm; Current Rating: 3A; Length: 12.4mm
MTH1-MTH8 = CMP-006-000010-2: MTH - MOUNTING HOLE M3 NON-PLATED - M3; Value: *; Component Type: Standard (No BOM); Package: M3; HelpURL: https://littlemachineshop.com/images/gallery/PDF/TapDrillSizes.pdf; Polarized: *; Pin Count: 0; Note: *; Assembly Type: NONE; Part Number #1: *; Source: CEGEP_SHERBROOKE_TGE_LIBRARY.SchLib; Design Item ID: MTH_M3_NON_PLATED; Power Max: *; Manufacturer #1: *
Q1 = CMP-32901-000276-1: MOSFET N-CH 100V 9.7A TO-220AB; Max Power Dissipation: 48W; Drain to Source Resistance: 200mR; Input Capacitance: 330pF; Gate to Source Voltage (Vgs): 20V; Element Configuration: Single; Threshold Voltage: 4V; Rise Time: 23ns; Turn-On Delay Time: 4.5ns; Turn-Off Delay Time: 32ns; Case/Package: TO-220; Power Dissipation: 48W; Drain to Source Voltage (Vdss): 100V; Continuous Drain Current (ID): 9.7A; Width: 0.185inch; Packaging: Rail/Tube; Mount: Through Hole; Max Operating Temperature: 175°C; Rds On Max: 200mR; Number of Pins: 3; Drain to Source Breakdown Voltage: 100V; Lead Free: Lead Free; Contact Plating: Tin; Height: 0.6inch; Min Operating Temperature: -55°C; RoHS Compliant: Yes; Length: 0.414inch; REACH SVHC: No SVHC; Halogen Free: Halogen Free; Max Dual Supply Voltage: 100V
Q2-Q5 = 74HC1G125GV-Q100H NXP Semiconductors: Bus Driver, HC/UH Series, 1-Func, 1-Bit, True Output, CMOS, PDSO5; Supply Voltage-Max: 6V; Supply Voltage-Min: 2V; Supply Voltage-Nominal: 5V; ComponentLink1Description: New link; ComponentLink1URL: https://www.snapeda.com/parts/74HC1G125GV-Q100H/Nexperia/view-part/?welcome=home&ref=octopart; Surface Mount: Yes
R20-R28 = 470 ohm: Custom Semiconductor Resistor
J29 = TSW-120-25-G-D: Package: None; Price: None; Value: *; MP: TSW-120-25-G-D; Availability: Unavailable

## Nets that join several sheets
3V3: Énigme1_Switch (9 pins), Énigme2_Crocodile (R10.2), Énigme3_Potentiomètres (J13.1 J14.1 J15.1 R19.2), Raspberry_Pi_4_ModelB (10 pins)
GND: Énigme1_Switch (19 pins), Énigme2_Crocodile (19 pins), Énigme3_Potentiomètres (17 pins), Raspberry_Pi_4_ModelB (37 pins)
VUSB: Énigme1_Switch (C1.1 U1.13 U1.14), Énigme2_Crocodile (C2.1 U2.13 U2.14), Énigme3_Potentiomètres (C3.1 U3.13 U3.14), Raspberry_Pi_4_ModelB (21 pins)
Reset_Croco: Énigme2_Crocodile (R10.1 U2.4), Raspberry_Pi_4_ModelB (J29.36)
Reset_Pot: Énigme3_Potentiomètres (R19.1 U3.4), Raspberry_Pi_4_ModelB (J29.31)
Reset_Switch: Énigme1_Switch (R3.1 U1.4), Raspberry_Pi_4_ModelB (J29.38)
SCL: Énigme1_Switch (U1.9), Énigme2_Crocodile (U2.9), Énigme3_Potentiomètres (U3.9), Raspberry_Pi_4_ModelB (J19.4 J29.05 R23.2)
SDA: Énigme1_Switch (U1.8), Énigme2_Crocodile (U2.8), Énigme3_Potentiomètres (U3.8), Raspberry_Pi_4_ModelB (J19.3 J29.03 R22.1)